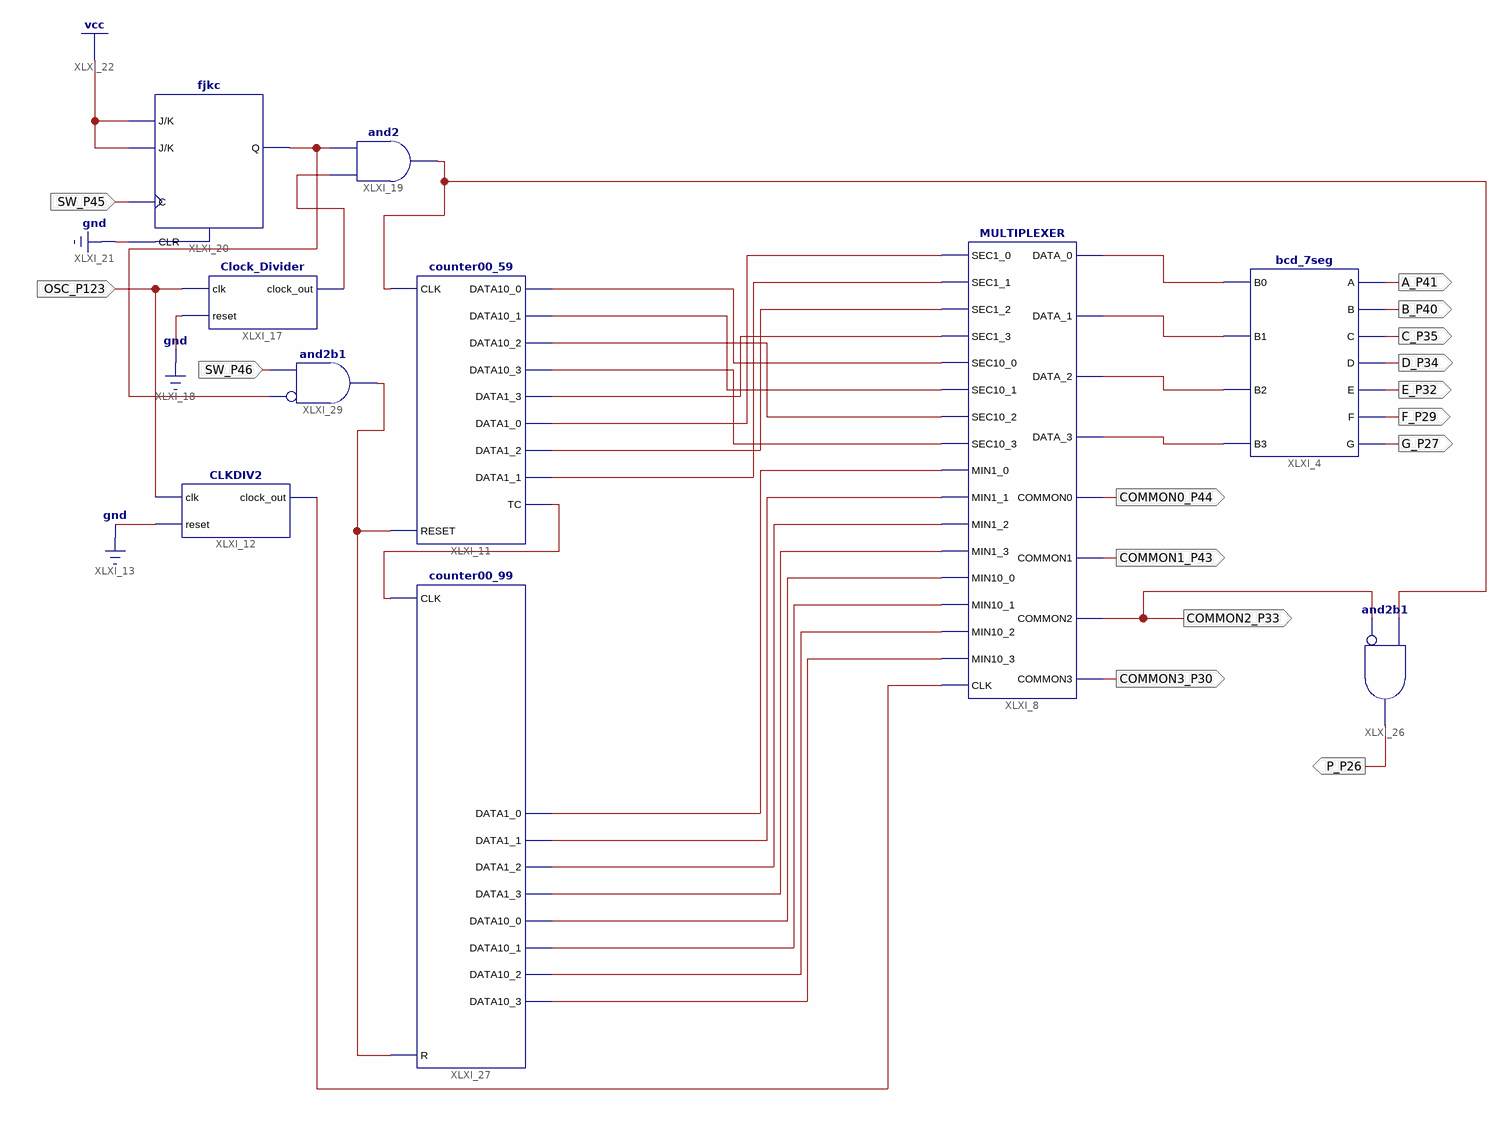
[diagram p0: schematic sheet 1]
// Xilinx ISE schematic Lab07.sch (spartan6) as structural Verilog: 10 symbols, 15 ports
module Lab07 (
  input  OSC_P123,
  input  SW_P45,
  input  SW_P46,
  output A_P41,
  output B_P40,
  output C_P35,
  output D_P34,
  output E_P32,
  output F_P29,
  output G_P27,
  output COMMON0_P44,
  output COMMON1_P43,
  output COMMON2_P33,
  output COMMON3_P30,
  output P_P26
);

  wire XLXN_45, XLXN_46, XLXN_47, XLXN_48, XLXN_54, XLXN_55, XLXN_56, XLXN_57, XLXN_58, XLXN_59, XLXN_60,
       XLXN_61, XLXN_62, XLXN_63, XLXN_64, XLXN_65, XLXN_66, XLXN_67, XLXN_68, XLXN_69, XLXN_73, XLXN_86,
       XLXN_108, XLXN_119, XLXN_125, XLXN_128;

  bcd_7seg XLXI_4 (
    .B0(XLXN_45), .B1(XLXN_46), .B2(XLXN_47), .B3(XLXN_48), .A(A_P41), .B(B_P40), .C(C_P35), .D(D_P34),
    .E(E_P32), .F(F_P29), .G(G_P27));
  MULTIPLEXER XLXI_8 (
    .SEC1_0(XLXN_54), .SEC1_1(XLXN_55), .SEC1_2(XLXN_56), .SEC1_3(XLXN_57), .SEC10_0(XLXN_58),
    .SEC10_1(XLXN_59), .SEC10_2(XLXN_60), .SEC10_3(XLXN_61), .MIN1_0(XLXN_62), .MIN1_1(XLXN_63),
    .MIN1_2(XLXN_64), .MIN1_3(XLXN_65), .MIN10_0(XLXN_66), .MIN10_1(XLXN_67), .MIN10_2(XLXN_68),
    .MIN10_3(XLXN_69), .CLK(XLXN_73), .DATA_0(XLXN_45), .DATA_1(XLXN_46), .DATA_2(XLXN_47), .DATA_3(XLXN_48),
    .COMMON0(COMMON0_P44), .COMMON1(COMMON1_P43), .COMMON2(COMMON2_P33), .COMMON3(COMMON3_P30));
  counter00_59 XLXI_11 (
    .CLK(XLXN_108), .RESET(XLXN_128), .DATA10_0(XLXN_58), .DATA10_1(XLXN_59), .DATA10_2(XLXN_60),
    .DATA10_3(XLXN_61), .TC(XLXN_119), .DATA1_2(XLXN_56), .DATA1_1(XLXN_55), .DATA1_0(XLXN_54),
    .DATA1_3(XLXN_57));
  CLKDIV2 XLXI_12 (.clk(OSC_P123), .reset(1'b0), .clock_out(XLXN_73));
  Clock_Divider XLXI_17 (.clk(OSC_P123), .reset(1'b0), .clock_out(XLXN_86));
  and XLXI_19 (XLXN_108, XLXN_86, XLXN_125);
  fjkc XLXI_20 (.C(SW_P45), .CLR(1'b0), .J(1'b1), .K(1'b1), .Q(XLXN_125));
  counter00_99 XLXI_27 (
    .CLK(XLXN_119), .R(XLXN_128), .DATA1_0(XLXN_62), .DATA1_1(XLXN_63), .DATA1_2(XLXN_64), .DATA1_3(XLXN_65),
    .DATA10_0(XLXN_66), .DATA10_1(XLXN_67), .DATA10_2(XLXN_68), .DATA10_3(XLXN_69));
  and XLXI_26 (P_P26, ~COMMON2_P33, XLXN_108);  // and2b1
  and XLXI_29 (XLXN_128, ~XLXN_125, SW_P46);  // and2b1
endmodule
